# Altium schematic sheet AnalogADCs.SchDoc: ADC
size Letter; Engineer: Nathan Petersen; DocumentNumber: 10; Revision: v1.2; SheetNumber: 10; SheetTotal: 23
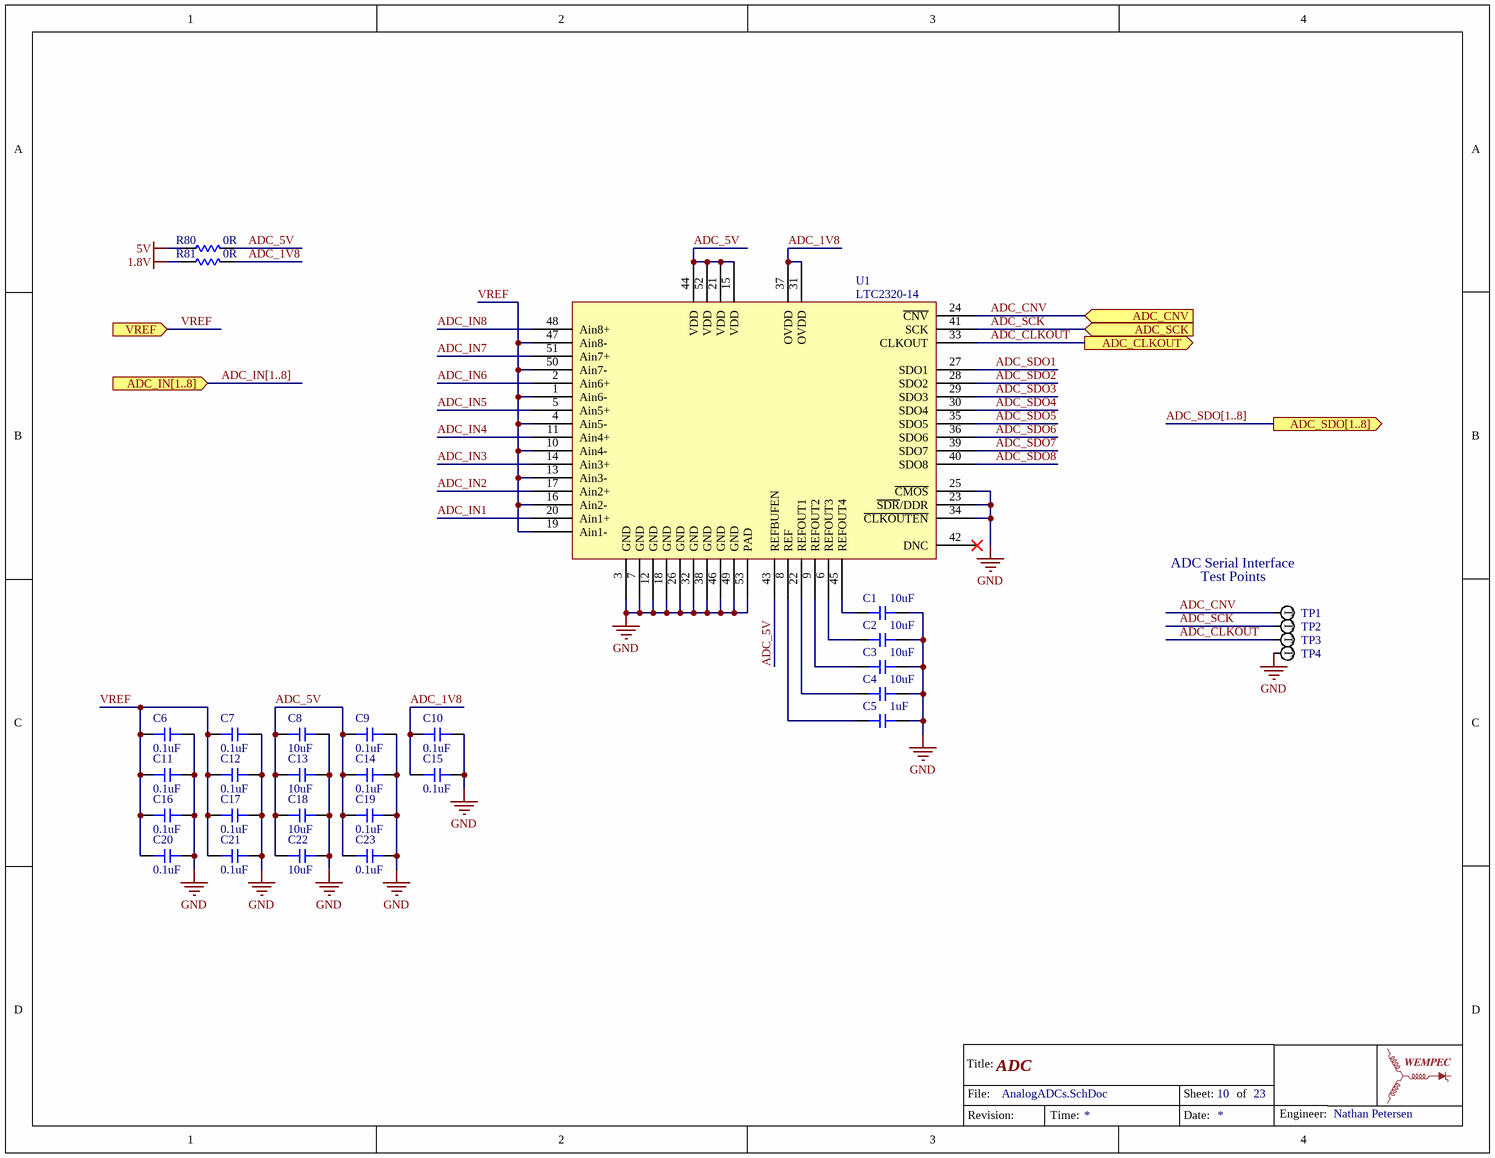
[diagram p0: AnalogADCs.SchDoc]

## Parts
C1  value 10uF  [0603-CAP]  (hidden comment: Capacitor)
C2  value 10uF  [0603-CAP]  (hidden comment: Capacitor)
C3  value 10uF  [0603-CAP]  (hidden comment: Capacitor)
C4  value 10uF  [0603-CAP]  (hidden comment: Capacitor)
C5  value 1uF  [0603-CAP]  (hidden comment: Capacitor)
C6  value 0.1uF  [0603-CAP]  (hidden comment: Capacitor)
C7  value 0.1uF  [0603-CAP]  (hidden comment: Capacitor)
C8  value 10uF  [0603-CAP]  (hidden comment: Capacitor)
C9  value 0.1uF  [0603-CAP]  (hidden comment: Capacitor)
C10  value 0.1uF  [0603-CAP]  (hidden comment: Capacitor)
C11  value 0.1uF  [0603-CAP]  (hidden comment: Capacitor)
C12  value 0.1uF  [0603-CAP]  (hidden comment: Capacitor)
C13  value 10uF  [0603-CAP]  (hidden comment: Capacitor)
C14  value 0.1uF  [0603-CAP]  (hidden comment: Capacitor)
C15  value 0.1uF  [0603-CAP]  (hidden comment: Capacitor)
C16  value 0.1uF  [0603-CAP]  (hidden comment: Capacitor)
C17  value 0.1uF  [0603-CAP]  (hidden comment: Capacitor)
C18  value 10uF  [0603-CAP]  (hidden comment: Capacitor)
C19  value 0.1uF  [0603-CAP]  (hidden comment: Capacitor)
C20  value 0.1uF  [0603-CAP]  (hidden comment: Capacitor)
C21  value 0.1uF  [0603-CAP]  (hidden comment: Capacitor)
C22  value 10uF  [0603-CAP]  (hidden comment: Capacitor)
C23  value 0.1uF  [0603-CAP]  (hidden comment: Capacitor)
R80  value 0R  [1206-RES]  (hidden comment: Resistor)
R81  value 0R  [1206-RES]  (hidden comment: Resistor)
TP1  Test Point  [RCU-0C]  (value not drawn)
TP2  Test Point  [RCU-0C]  (value not drawn)
TP3  Test Point  [RCU-0C]  (value not drawn)
TP4  Test Point  [RCU-0C]  (value not drawn)
U1  LTC2320-14  [QFN50P700X800X80_HS-53N]

## Ports
ADC_CLKOUT (out), ADC_CNV (in), ADC_IN[1..8] (in), ADC_SCK (in), ADC_SDO[1..8] (out), VREF (in)

## Nets
1.8V: R81.1
5V: R80.1
GND: C1.2 C2.2 C3.2 C4.2 C5.2 C6.2 C7.2 C8.2 C9.2 C10.2 C11.2 C12.2 C13.2 C14.2 C15.2 C16.2 C17.2 C18.2 C19.2 C20.2 C21.2 C22.2 C23.2 TP4.1 U1.3(GND) U1.7(GND) U1.12(GND) U1.18(GND) U1.23(~{SDR}/DDR) U1.25(~{CMOS}) U1.26(GND) U1.32(GND) U1.34(~{CLKOUTEN}) U1.38(GND) U1.46(GND) U1.49(GND) U1.53(PAD)
ADC_1V8: C10.1 C15.1 R81.2 U1.31(OVDD) U1.37(OVDD)
ADC_5V: C8.1 C9.1 C13.1 C14.1 C18.1 C19.1 C22.1 C23.1 R80.2 U1.15(VDD) U1.21(VDD) U1.43(REFBUFEN) U1.44(VDD) U1.52(VDD)
ADC_CLKOUT: TP3.1 U1.33(CLKOUT) ; port ADC_CLKOUT
ADC_CNV: TP1.1 U1.24(~{CNV}) ; port ADC_CNV
ADC_IN1: U1.20(Ain1+)
ADC_IN2: U1.17(Ain2+)
ADC_IN3: U1.14(Ain3+)
ADC_IN4: U1.11(Ain4+)
ADC_IN5: U1.5(Ain5+)
ADC_IN6: U1.2(Ain6+)
ADC_IN7: U1.51(Ain7+)
ADC_IN8: U1.48(Ain8+)
ADC_SCK: TP2.1 U1.41(SCK) ; port ADC_SCK
ADC_SDO1: U1.27(SDO1)
ADC_SDO2: U1.28(SDO2)
ADC_SDO3: U1.29(SDO3)
ADC_SDO4: U1.30(SDO4)
ADC_SDO5: U1.35(SDO5)
ADC_SDO6: U1.36(SDO6)
ADC_SDO7: U1.39(SDO7)
ADC_SDO8: U1.40(SDO8)
VREF: C6.1 C7.1 C11.1 C12.1 C16.1 C17.1 C20.1 C21.1 U1.1(Ain6-) U1.4(Ain5-) U1.10(Ain4-) U1.13(Ain3-) U1.16(Ain2-) U1.19(Ain1-) U1.47(Ain8-) U1.50(Ain7-) ; port VREF
NetC1_1: C1.1 U1.45(REFOUT4)
NetC2_1: C2.1 U1.6(REFOUT3)
NetC3_1: C3.1 U1.9(REFOUT2)
NetC4_1: C4.1 U1.22(REFOUT1)
NetC5_1: C5.1 U1.8(REF)

Not connected (* = marked no-connect by the designer): U1 42(DNC)*

## Buses and harness runs
bus ADC_IN[1..8] = port ADC_IN[1..8]
bus ADC_SDO[1..8] = port ADC_SDO[1..8]

## Notes on the sheet
- ADC Serial Interface
- Test Points
- Title:
- File:
- Sheet:
- of
- Revision:
- Time:
- Date:
- Engineer:
- (in symbol Test Point) T

## Library data of the parts
U1 = LTC2320-14: IC ADC 14BIT 1.5MSPS SAR 52QFN - 14 Bit Analog to Digital Converter 8 Input 4 SAR 52-QFN (7x8); Supplier 1: Digi-Key; Supplier Part Number 1: LTC2320CUKG-14#PBF-ND
C1-C23 = Capacitor: Supplier 1: Digi-Key
  C1: Supplier Part Number 1: 1276-1192-6-ND
  C2-C4 C8 C13 C18 C22: Supplier Part Number 1: 1276-1119-6-ND
  C5: Supplier Part Number 1: 1276-6524-6-ND
  C6 C7 C9-C12 C14-C17 C19-C21 C23: Supplier Part Number 1: 1276-1012-6-ND
R80 R81 = Resistor: Supplier 1: Digi-Key; Supplier Part Number 1: 311-0.0ERCT-ND
TP1-TP4 = Test Point: Footprint: *; Supplier 1: Digi-Key; Supplier Part Number 1: A106145CT-ND